# EAGLE schematic MultiDrop (EAGLE 7.6.0)
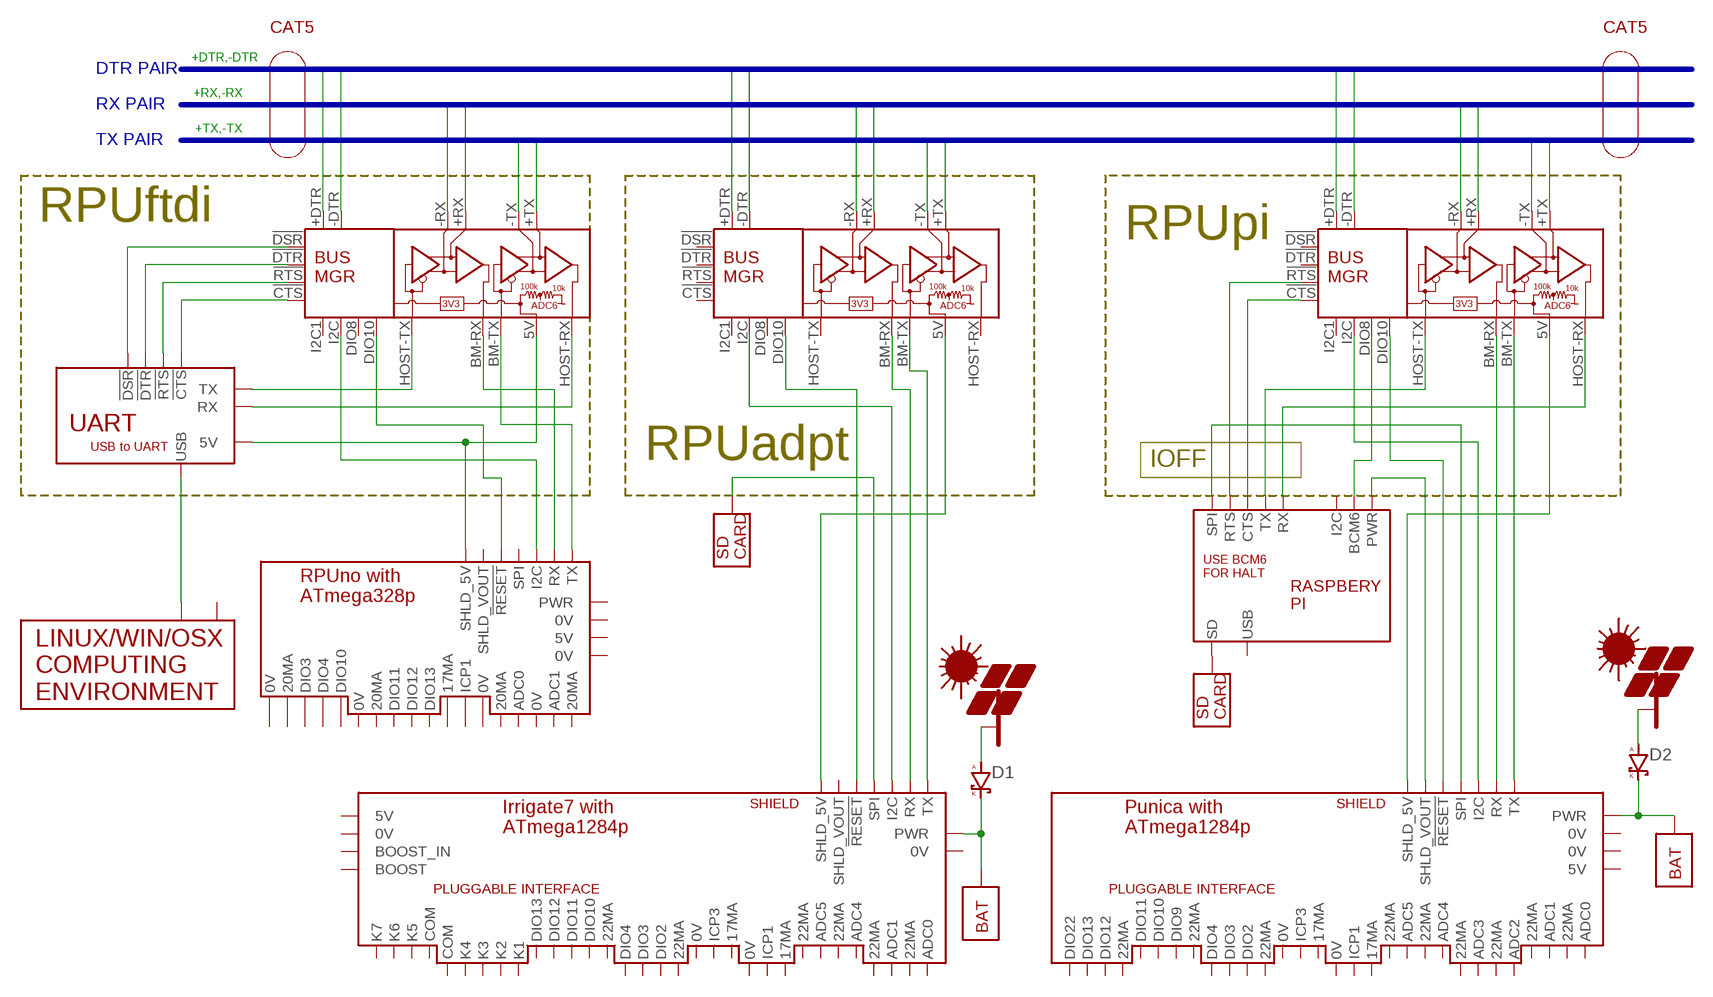
[diagram p0: schematic, sheet 1]

## Parts
BM2  RPUNO  [NA-30]
D1  DSMB  [SMB]
D2  DSMB  [SMB]
PM1  DESKTOP  [NA-30]
PV2  PV  [NA-30]
PV4  PV  [NA-30]
SD1  SD  [NA-30]
SD2  SD  [NA-30]
U$1  BUS_MGR  [WITH_RPU_NAMES]
U$2  BUS_MGR  [WITH_RPU_NAMES]
U$3  PI  [NA-30]
U$4  BUS_MGR  [WITH_RPU_NAMES]
U$5  IRRIGATE7  [WITH_RPU_NAMES]
U$7  BAT  [NA-30]
U$8  PUNICA  [WITH_RPU_NAMES]
U$9  BAT  [NA-30]
UART1  UART  [NA-30]

## Nets
+DTR: U$4.+DTR
+DTR1: U$2.+DTR
+DTR3: U$1.+DTR
+RX: U$4.+RX
+RX1: U$2.+RX
+RX3: U$1.+RX
+TX: U$4.+TX
+TX1: U$2.+TX
+TX3: U$1.+TX
-DTR: U$4.-DTR
-DTR1: U$2.-DTR
-DTR3: U$1.-DTR
-RX: U$4.-RX
-RX1: U$2.-RX
-RX3: U$1.-RX
-TX: U$4.-TX
-TX1: U$2.-TX
-TX3: U$1.-TX
N$1: BM2.1(TX) U$4.BM-TX(BM_TX)
N$2: BM2.2(RX) U$4.BM-RX(BM_RX)
N$3: PM1.1(RX) UART1.7(USB)
N$4: U$4.!CTS UART1.1(!CTS)
N$5: U$4.!RTS UART1.4(!RTS)
N$6: U$4.!DTR UART1.3(!DTR)
N$7: U$4.!DSR UART1.2(!DSR)
N$8: U$4.HOST-RX(HOST_RX) UART1.5(RX)
N$9: U$4.HOST-TX(HOST_TX) UART1.6(TX)
N$10: U$2.BM-TX(BM_TX) U$5.TX
N$11: U$2.BM-RX(BM_RX) U$5.RX
N$12: U$1.DIO8 U$3.7(BCM6)
N$13: U$1.5V(PWR) U$8.SHLD_5V
N$14: U$1.BM-TX(BM_TX) U$8.TX
N$15: D2.K U$7.1(BAT_PWR) U$8.PWR
N$16: D2.A PV4.1(PV_PWR)
N$17: D1.A PV2.1(PV_PWR)
N$18: D1.K U$5.PWR U$9.1(BAT_PWR)
N$19: SD1.1(PV_PWR) U$5.SPI
N$21: U$1.BM-RX(BM_RX) U$8.RX
N$22: U$1.!CTS U$3.1(CTS)
N$23: U$1.!RTS U$3.2(RTS)
N$25: U$3.10(SPI) U$8.SPI
N$26: U$1.HOST-RX(HOST_RX) U$3.3(RX)
N$27: U$1.HOST-TX(HOST_TX) U$3.4(TX)
N$28: SD2.1(PV_PWR) U$3.9(SD)
N$29: BM2.6(SHLD_5V) U$4.5V(PWR) UART1.8(5V)
N$30: BM2.5(!RESET) U$4.DIO10
N$32: U$1.I2C U$8.I2C
N$33: BM2.3(I2C) U$4.I2C
N$41: U$3.12(PWR) U$8.SHLD_VOUT
N$43: U$1.DIO10 U$8.!RESET
N$44: U$2.DIO10 U$5.!RESET
N$45: U$2.5V(PWR) U$5.SHLD_5V
N$48: U$2.I2C U$5.I2C
Unconnected: BM2.4(SPI) BM2.7(SHLD_VOUT) BM2.8(PWR) BM2.9(0V) BM2.10(ADC0) BM2.11(ADC1) BM2.12(ICP1) BM2.13(DIO3) BM2.14(DIO4) BM2.15(DIO10) BM2.16(DIO11) BM2.17(DIO12) BM2.18(DIO13) BM2.19(5V) BM2.20(0V) BM2.21(17MA) BM2.22(20MA) BM2.23(20MA) BM2.24(20MA) BM2.25(0V) BM2.26(0V) BM2.27(0V) BM2.28(0V) BM2.29(20MA) PM1.2(TX) U$1.!DSR U$1.!DTR U$1.I2C1 U$2.!CTS U$2.!DSR U$2.!DTR U$2.!RTS U$2.DIO8 U$2.HOST-RX(HOST_RX) U$2.HOST-TX(HOST_TX) U$2.I2C1 U$3.8(I2C) U$3.11(USB) U$4.DIO8 U$4.I2C1 U$5.0V U$5.0V@ICP1(0V) U$5.0V@ICP3(0V) U$5.0V@PWR(0V) U$5.5V U$5.17MA@ICP1(17MA) U$5.17MA@ICP3(17MA) U$5.22MA@ADC0(22MA) U$5.22MA@ADC1(22MA) U$5.22MA@ADC4(22MA) U$5.22MA@ADC5(22MA) U$5.22MA@DIO2(22MA) U$5.22MA@DIO10(22MA) U$5.ADC0 U$5.ADC1 U$5.ADC4 U$5.ADC5 U$5.BOOST U$5.BOOST_IN U$5.COM@K4(COM) U$5.COM@K5(COM) U$5.DIO2 U$5.DIO3 U$5.DIO4 U$5.DIO10 U$5.DIO11 U$5.DIO12 U$5.DIO13 U$5.ICP1 U$5.ICP3 U$5.K1 U$5.K2 U$5.K3 U$5.K4 U$5.K5 U$5.K6 U$5.K7 U$5.SHLD_VOUT U$8.0V U$8.0V@ICP1(0V) U$8.0V@ICP3(0V) U$8.0V@PWR(0V) U$8.5V U$8.17MA@ICP1(17MA) U$8.17MA@ICP3(17MA) U$8.22MA@ADC0(22MA) U$8.22MA@ADC1(22MA) U$8.22MA@ADC2(22MA) U$8.22MA@ADC3(22MA) U$8.22MA@ADC4(22MA) U$8.22MA@ADC5(22MA) U$8.22MA@DIO2(22MA) U$8.22MA@DIO9(22MA) U$8.22MA@DIO12(22MA) U$8.ADC0 U$8.ADC1 U$8.ADC2 U$8.ADC3 U$8.ADC4 U$8.ADC5 U$8.DIO2 U$8.DIO3 U$8.DIO4 U$8.DIO9 U$8.DIO10 U$8.DIO11 U$8.DIO12 U$8.DIO13 U$8.DIO22 U$8.ICP1 U$8.ICP3

## Buses
+DTR,-DTR
+RX,-RX
+TX,-TX

## Notes on the sheet
- CAT5 | CAT5
- DTR PAIR
- RX PAIR
- TX PAIR
- RPUftdi
- RPUpi
- RPUadpt | IOFF

## Library data of the parts
BM2 = Documentation:RPUNO: BM /w 328p
D1 D2 = D-SBR:D: DIODE
PM1 = Documentation:DESKTOP: Protected Mode
PV2 PV4 = Documentation:PV
SD1 SD2 = Documentation:SD
U$1 U$2 U$4 = Documentation:BUS_MGR: RPU BUS MANAGER
U$3 = Documentation:PI: Raspbery Pi
U$5 = Documentation:IRRIGATE7: BM /w 1284p
U$7 U$9 = Documentation:BAT
U$8 = Documentation:PUNICA
UART1 = Documentation:UART: UART e.g. FTDI FT231X